# EAGLE design EEG (EAGLE 7.6.0)
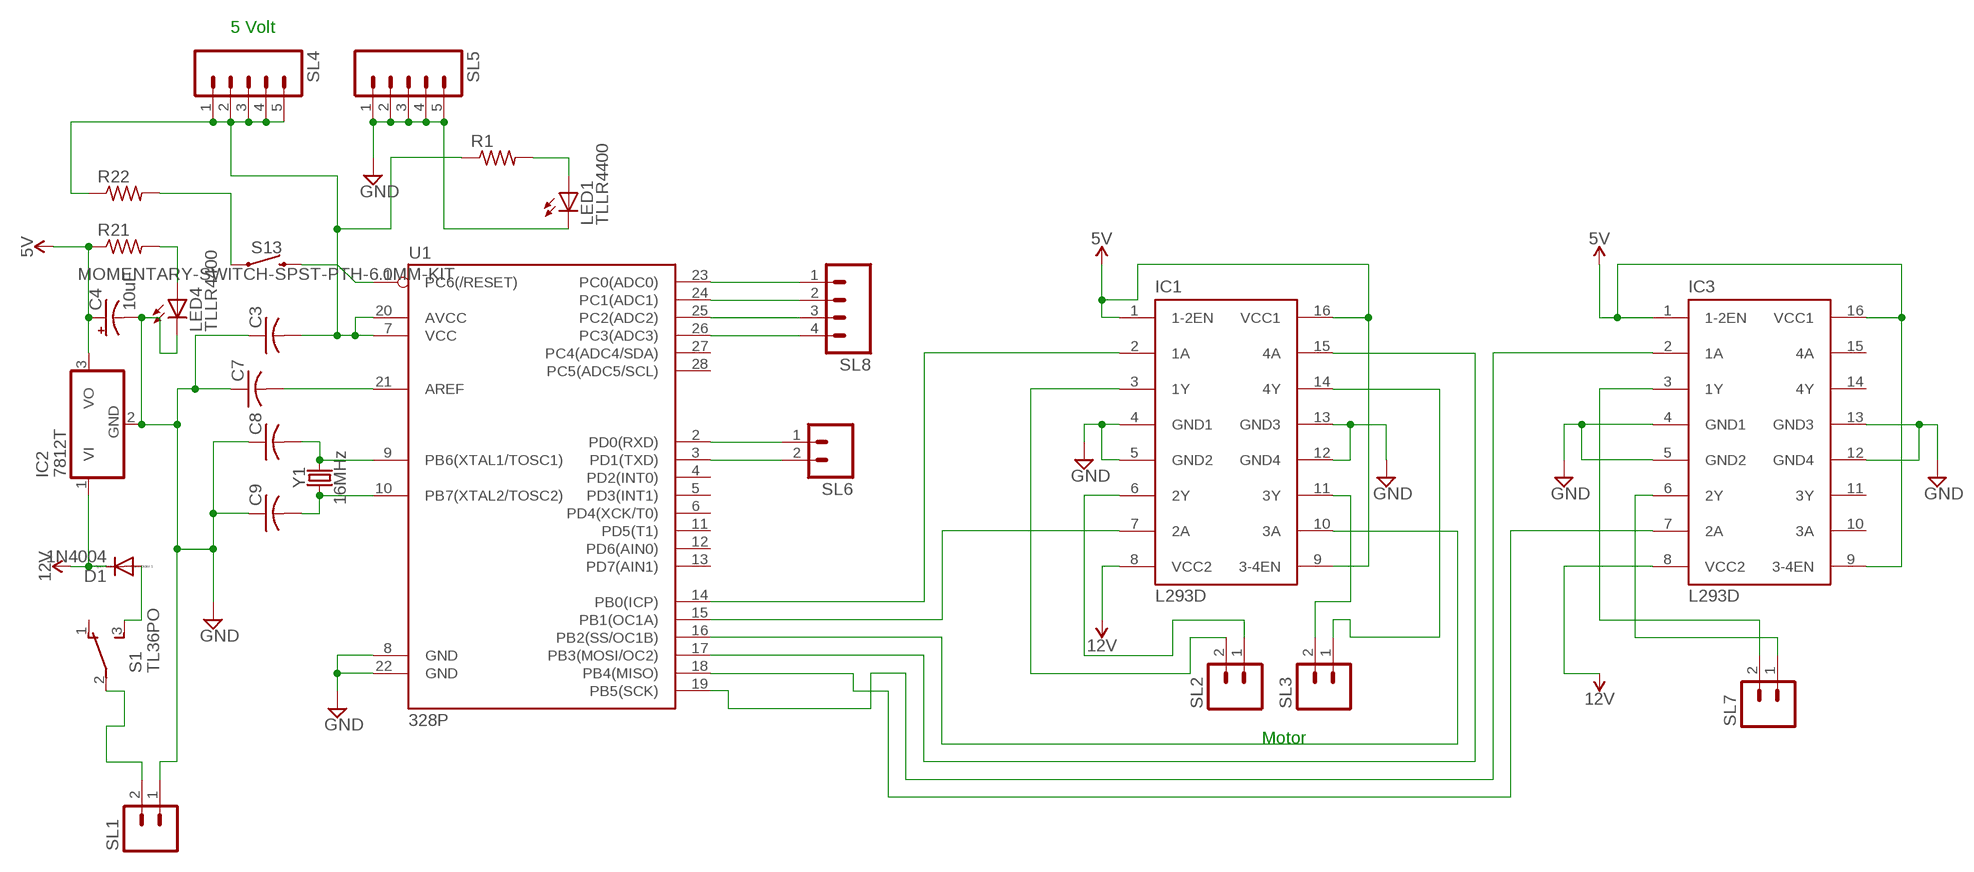
[diagram p0: schematic, sheet 1]

## Parts
C3  C-US025-025X050  [C025-025X050]
C4  10uF  10UF-POLAR-RADIAL-2.5MM-KIT-25V-20%  [CPOL-RADIAL-2.5MM-5MM-KIT]
C7  C-US025-025X050  [C025-025X050]
C8  C-US025-025X050  [C025-025X050]
C9  C-US025-025X050  [C025-025X050]
D1  1N4004  [DO41-10]
IC1  L293D  [DIL16]
IC2  7812T  [TO220H]
IC3  L293D  [DIL16]
LED1  TLLR4400  [LED3MM]
LED4  TLLR4400  [LED3MM]
R1  R-US_0207/12  [0207/12]
R21  R-US_0207/12  [0207/12]
R22  R-US_0207/12  [0207/12]
S1  TL36PO  [TL3XPO]
S13  MOMENTARY-SWITCH-SPST-PTH-6.0MM-KIT  [TACTILE_SWITCH_PTH_6.0MM_KIT]
SL1  MA02  [02PA]
SL2  MA02  [02PA]
SL3  MA02  [02PA]
SL4  MA05  [05PA]
SL5  MA05  [05PA]
SL6  MA02  [02PA]
SL7  MA02  [02PA]
SL8  MA04  [04PA]
U1  328P  ATMEGA328P_PDIP  [DIP28]
Y1  16MHz  CRYSTAL-16MHZPTH-HC49US  [HC49US]

## Nets
5V: C4.1(+) IC1.1(1-2EN) IC1.9(3-4EN) IC1.16(VCC1) IC2.3(VO) IC3.1(1-2EN) IC3.9(3-4EN) IC3.16(VCC1) R21.1
12V: D1.C IC1.8(VCC2) IC2.1(VI) IC3.8(VCC2)
GND: C3.1 C4.2(-) C7.1 C8.1 C9.1 IC1.4(GND1) IC1.5(GND2) IC1.12(GND4) IC1.13(GND3) IC2.2(GND) IC3.4(GND1) IC3.5(GND2) IC3.12(GND4) IC3.13(GND3) LED1.K(C) LED4.K(C) SL1.1 SL5.1 SL5.2 SL5.3 SL5.4 SL5.5 U1.8(GND) U1.22(GND)
N$1: C7.2 U1.21(AREF)
N$2: S1.2(P) SL1.2
N$3: C8.2 U1.9(PB6(XTAL1/TOSC1)) Y1.2
N$4: C9.2 U1.10(PB7(XTAL2/TOSC2)) Y1.1
N$5: LED4.A R21.2
N$6: D1.A S1.3(S)
N$7: IC1.3(1Y) SL2.2
N$8: R22.2 S13.1
N$9: S13.3 U1.1(PC6(/RESET))
N$10: IC3.2(1A) U1.19(PB5(SCK))
N$11: IC3.7(2A) U1.18(PB4(MISO))
N$12: IC3.3(1Y) SL7.2
N$13: IC1.2(1A) U1.14(PB0(ICP))
N$14: IC1.7(2A) U1.15(PB1(OC1A))
N$15: IC1.10(3A) U1.16(PB2(SS/OC1B))
N$16: IC1.15(4A) U1.17(PB3(MOSI/OC2))
N$17: C3.2 R1.1 R22.1 SL4.1 SL4.2 SL4.3 SL4.4 SL4.5 U1.7(VCC) U1.20(AVCC)
N$18: IC3.6(2Y) SL7.1
N$20: LED1.A R1.2
N$21: SL6.1 U1.2(PD0(RXD))
N$22: SL6.2 U1.3(PD1(TXD))
N$24: SL8.1 U1.23(PC0(ADC0))
N$25: SL8.2 U1.24(PC1(ADC1))
N$26: SL8.3 U1.25(PC2(ADC2))
N$27: SL8.4 U1.26(PC3(ADC3))
N$31: IC1.14(4Y) SL3.1
N$33: IC1.6(2Y) SL2.1
N$34: IC1.11(3Y) SL3.2
Unconnected: IC3.10(3A) IC3.11(3Y) IC3.14(4Y) IC3.15(4A) S1.1(O) U1.4(PD2(INT0)) U1.5(PD3(INT1)) U1.6(PD4(XCK/T0)) U1.11(PD5(T1)) U1.12(PD6(AIN0)) U1.13(PD7(AIN1)) U1.27(PC4(ADC4/SDA)) U1.28(PC5(ADC5/SCL))

## Notes on the sheet
- 5 Volt
- Motor

## Library data of the parts
C3 C7-C9 = adafruit:C-US: CAPACITOR, American symbol
C4 = SparkFun-Capacitors:10UF-POLAR: 10.0µF polarized capacitors A capacitor is a passive two-terminal electrical component used to store electrical energy temporarily in an electric field.; PROD_ID: CAP-08440
D1 = diode:1N4004: DIODE general purpose rectifier, 1 A
IC1 IC3 = st-microelectronics:L293D: PUSH-PULL 4 CHANNEL DRIVER; MPN: L293D; OC_FARNELL: 9589619; OC_NEWARK: 56P8249
IC2 = linear:78*: Positive VOLTAGE REGULATOR Source: http://cache.national.com/ds/LM/LM78L05.pdf http://www.fairchildsemi.com/ds/LM/LM7805.pdf
LED1 LED4 = led:TLLR4400: Low Current (2mA) LED 3 mm Tinted Diffused Package color RED Source: Data sheet <http://www.farnell.com/datasheets/391100.pdf>; MF: VISHAY SEMICONDUCTOR; OC_FARNELL: 1612437
R1 R21 R22 = rcl:R-US_: RESISTOR, American symbol
S1 = switch:TL36PO: TINY SWITCH ON - ON Source: http://www2.produktinfo.conrad.com/datenblaetter/700000-724999/705152-da-01-de-Subminiaturschalter_TL_36YO.pdf
S13 = SparkFun-Switches:MOMENTARY-SWITCH-SPST: Momentary Switch (Pushbutton) - SPST Normally-open (NO) SPST momentary switches (buttons, pushbuttons). Variants PTH-12MM - 12mm square, through-hole Momentary Pushbutton Switch - 12mm Square <https://www.sparkfun.com/products/9190> (COM-09190) PTH-6.0MM, PTH-6.0MM-KIT - 6.0mm square, through-hole Mini Pushbutton Switch <https://www.sparkfun.com/products/97> (COM-00097) KIT package intended for soldering kit's - only one side of pads' copper is exposed. PTH-RIGHT-ANGLE-KIT - Right-angle, through-hole Right Angle Tactile Button <https://www.sparkfun.com/products/10791> - Used on SparkFun BigTime Watch Kit <https://www.sparkfun.com/products/11734> SMD-12MM - 12mm square, surface-mount Tactile Button - SMD (12mm) <https://www.sparkfun.com/products/12993> (COM-12993) Used on SparkFun PicoBoard <https://www.sparkfun.com/products/11888> SMD-4.5MM - 4.5mm Square Trackball Switch Used on SparkFun Blackberry Trackballer Breakout <https://www.sparkfun.com/products/13169> SMD-4.6MMX2.8MM - 4.60mm x 2.80mm, surface mount Used on SparkFun SAMD21 Mini Breakout <https://www.sparkfun.com/products/13664> SMD-5.2MM, SMD-5.2-REDUNDANT - 5.2mm square, surface-mount Mini Pushbutton Switch - SMD <https://www.sparkfun.com/products/8720> (COM-08720) Used on Arduino Pro Mini <https://www.sparkfun.com/products/11114> REDUNDANT package connects both switch circuits together SMD-6.0X3.5MM - 6.0 x 3.5mm, surface mount Momentary Reset Switch SMD <https://www.sparkfun.com/products/8229> (COM-08229) SMD-6.2MM-TALL - 6.2mm square, surface mount Tactile Button - SMD (6mm) <https://www.sparkfun.com/products/12992> Used on SparkFun Digital Sandbox <https://www.sparkfun.com/products/12651> SMD-RIGHT-ANGLE - Right-angle, surface mount Used on SparkFun Block for Intel® Edison - Arduino <https://www.sparkfun.com/products/13036>; PROD_ID: SWCH-08441; SF_SKU: COM-00097
SL1-SL3 SL6 SL7 = con-amp-quick:MA02: AMP QUICK CONNECTOR; OC_FARNELL: unknown; OC_NEWARK: unknown
SL4 SL5 = con-amp-quick:MA05: AMP QUICK CONNECTOR; OC_FARNELL: unknown; OC_NEWARK: unknown
SL8 = con-amp-quick:MA04: AMP QUICK CONNECTOR; OC_FARNELL: unknown; OC_NEWARK: unknown
U1 = SparkFun-IC-Microcontroller:ATMEGA328P_PDIP: Atmel 328P Through hole ATMEGA328P uC used in the Arduino 32kb flash, 1k EEPROM, 2k SRAM Datasheet <http://www.sparkfun.com/datasheets/Components/SMD/ATMega328.pdf> SparkFun Products Storefront component: AVR 28 Pin 20MHz 32K 6A/D - ATMega328P <https://www.sparkfun.com/products/9061> (COM-09061) SparkFun Simon Says - Through-Hole Soldering Kit <https://www.sparkfun.com/products/10547> (KIT-10547) SparkFun Learn to Solder - Simon Says <https://www.sparkfun.com/products/13708> (KIT-13708) SparkFun BigTime Watch Kit <https://www.sparkfun.com/products/11734> (KIT-11734) SparkFun ClockIt <https://www.sparkfun.com/products/10930> (KIT-10930) SparkFun Serial Enabled LCD Kit <https://www.sparkfun.com/products/10097> (LCD-10097) SparkFun Simon Tilts - Through Hole Soldering Kit <https://www.sparkfun.com/products/12634> (KIT-12634) SparkFun Frequency Counter Kit <https://www.sparkfun.com/products/10140> (KIT-10140) FabFM Radio Kit <https://www.sparkfun.com/products/11043> (KIT-11043) SparkFun Binary Blaster Kit <https://www.sparkfun.com/products/12037> (KIT-12037) SparkFun Metro-Gnome <https://www.sparkfun.com/products/9236> (KIT-09236) ATmega328 with Arduino Optiboot (Uno) <https://www.sparkfun.com/products/10524> (DEV-10524); PROD_ID: IC-09136
Y1 = SparkFun-Clocks:CRYSTAL-16MHZ: 16MHz Crystal Digikey Example <http://www.digikey.com/product-search/en?keywords=535-9122-1-ND> Frequency: 16MHz Frequency Stability: ±50ppm Frequency Tolerance: ±20ppm Load Capacitance: 18pF SparkFun Products: Pro Micro -5V/16MHz <https://www.sparkfun.com/products/12640> SparkFun Serial Enabled LCD Kit <https://www.sparkfun.com/products/10097>; PROD_ID: XTAL-08181; SF_ID: COM-00536

## Board
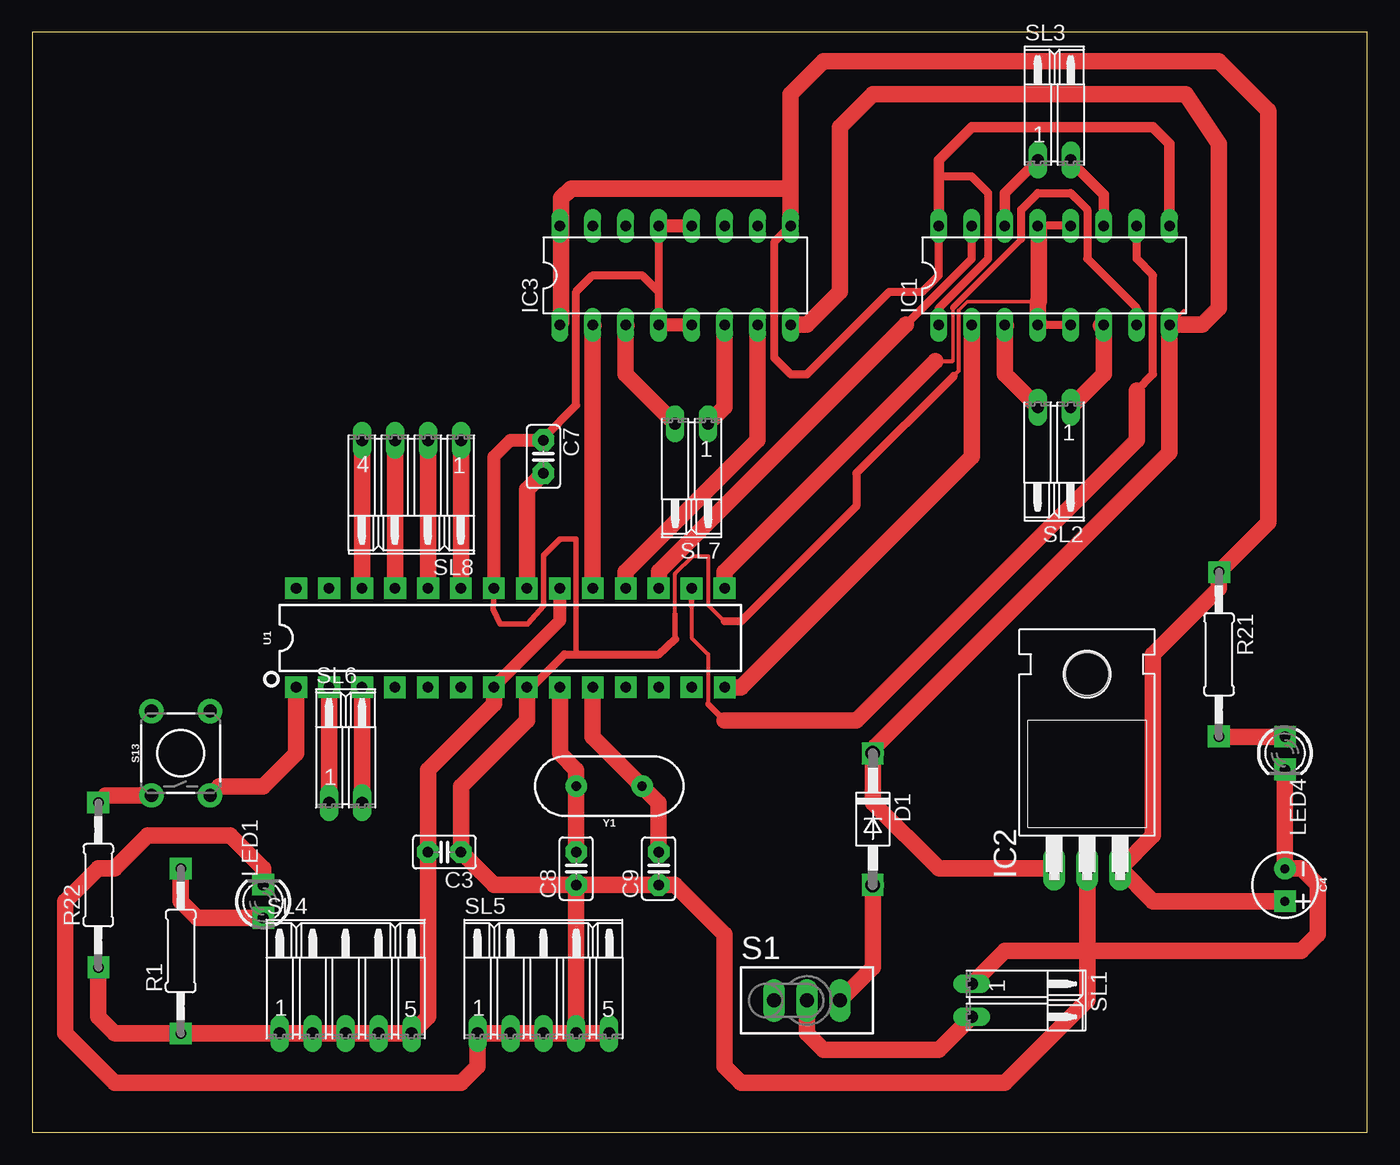
[diagram p1: board, top side]

Size 102.85 x 84.76 mm. Coordinates in mm from the lower left corner, seen from the top.
Outline: 0,0 102.85,0 102.85,84.76 0,84.76 0,0
Copper layers (1*16): Top 0.035mm / dielectric 1.5mm / Bottom 0.035mm
Design rules "default": minimum track width 10mil, minimum drill 24mil, track to track 8mil, track to pad 8mil, pad to pad 8mil, via to via 8mil, smd to smd 8mil, copper to edge 40mil, drill to drill 8mil, minimum pad ring 10mil, minimum via ring 8mil, stop-mask expansion 4mil, vias tented up to drill 0mil, thermal gap 10mil

### Footprints (pad centres in the part's own frame; a part is rotated, then mirrored left to right if it is on the bottom)
C025-025X050 = drill 0.813 pad 1.676 octagon: 1 -1.27,0; 2 1.27,0
CPOL-RADIAL-2.5MM-5MM-KIT = drill 0.7 pad 1.651 square: 1 1.25,0 | drill 0.7 pad 1.651: 2 -1.25,0
DO41-10 = drill 1.118: A 5.08,0; C -5.08,0
DIL16 = drill 0.813 long: 1 -8.89,-3.81; 2 -6.35,-3.81; 3 -3.81,-3.81; 4 -1.27,-3.81; 5 1.27,-3.81; 6 3.81,-3.81; 7 6.35,-3.81; 8 8.89,-3.81; 9 8.89,3.81; 10 6.35,3.81; 11 3.81,3.81; 12 1.27,3.81; 13 -1.27,3.81; 14 -3.81,3.81; 15 -6.35,3.81; 16 -8.89,3.81
TO220H = drill 1.118 long: 1 -2.54,-10.16; 2 0,-10.16; 3 2.54,-10.16 | hole 3.302: 0,4.826
LED3MM = drill 0.813 octagon: A -1.27,0; K 1.27,0
0207/12 = drill 0.813 octagon: 1 -6.35,0; 2 6.35,0
TL3XPO = drill 1.1 pad 1.422 long: 1 -2.54,0; 2 0,0; 3 2.54,0
TACTILE_SWITCH_PTH_6.0MM_KIT = drill 1.016 pad 1.88: 1 -3.251,2.261; 2 3.251,2.261; 3 -3.251,-2.261; 4 3.251,-2.261
02PA = drill 0.914 long: 1 -1.27,0; 2 1.27,0
05PA = drill 0.914 long: 1 -5.08,0; 2 -2.54,0; 3 0,0; 4 2.54,0; 5 5.08,0
04PA = drill 0.914 long: 1 -3.81,0; 2 -1.27,0; 3 1.27,0; 4 3.81,0
DIP28 = drill 0.813 pad 1.626: 1 -16.51,-3.81; 2 -13.97,-3.81; 3 -11.43,-3.81; 4 -8.89,-3.81; 5 -6.35,-3.81; 6 -3.81,-3.81; 7 -1.27,-3.81; 8 1.27,-3.81; 9 3.81,-3.81; 10 6.35,-3.81; 11 8.89,-3.81; 12 11.43,-3.81; 13 13.97,-3.81; 14 16.51,-3.81; 15 16.51,3.81; 16 13.97,3.81; 17 11.43,3.81; 18 8.89,3.81; 19 6.35,3.81; 20 3.81,3.81; 21 1.27,3.81; 22 -1.27,3.81; 23 -3.81,3.81; 24 -6.35,3.81; 25 -8.89,3.81; 26 -11.43,3.81; 27 -13.97,3.81; 28 -16.51,3.81
HC49US = drill 0.7 pad 1.651: 1 -2.54,0; 2 2.54,0

### Placement (x,y rotation side)
C3  31.75,21.59 180 top
C4  96.52,19.05 270 top
C7  39.37,52.07 270 top
C8  41.91,20.32 90 top
C9  48.26,20.32 90 top
D1  64.77,24.13 270 top
IC1  78.74,66.04 0 top
IC2  81.28,30.48 0 top
IC3  49.53,66.04 0 top
LED1  17.78,17.78 90 top
LED4  96.52,29.21 270 top
R1  11.43,13.97 90 top
R21  91.44,36.83 270 top
R22  5.08,19.05 90 top
S1  59.69,10.16 0 top
S13  11.43,29.21 90 top
SL1  72.39,10.16 270 top
SL2  78.74,55.88 180 top
SL3  78.74,74.93 0 top
SL4  24.13,7.62 0 top
SL5  39.37,7.62 0 top
SL6  24.13,25.4 0 top
SL7  50.8,54.61 180 top
SL8  29.21,53.34 180 top
U1  36.83,38.1 0 top
Y1  44.45,26.67 180 top

### Tracks (layer width: path | path; a pad name or v marks a point on that pad's centre or on a via)
5V
  Top 0.254: 40.74,62.41 IC3.1 | 40.74,69.72 IC3.16 | 57.89,69.95 58.34,69.95 IC3.9 | 69.77,69.72 IC1.16
  Top 0.61: IC1.1 69.85,63.5 73.66,67.31 73.66,72.39 72.39,73.66 69.85,73.66 | IC3.9 57.15,68.58 57.15,59.69 58.42,58.42 59.69,58.42 66.04,64.77 68.58,64.77 69.85,66.04 IC1.16
  Top 0.813: 69.77,69.72 69.85,69.8 IC1.16 69.85,73.66 69.85,74.93 72.39,77.47 86.36,77.47 87.63,76.2 IC1.9
  Top 1.27: C4.1 96.5,17.78 86.36,17.78 IC2.3 86.36,22.86 86.36,36.83 91.44,41.91 R21.1 95.25,46.99 95.25,78.74 91.44,82.55 60.96,82.55 58.42,80.01 58.42,72.63 | 58.42,72.63 IC3.9 | 40.74,62.41 40.74,69.72 40.74,69.75 | 40.74,69.75 IC3.16 | 40.74,69.75 40.74,71.98 41.49,72.72 58.32,72.72 58.42,72.63
12V
  Top 0.254: 88.75,63.32 87.83,62.41 IC1.8 87.61,62.18 87.61,60.58 | 58.57,62.41 IC3.8 | 64.97,29.72 D1.C
  Top 1.27: D1.C 64.77,25.4 69.85,20.32 IC2.1 | 64.97,29.72 87.63,52.38 IC1.8 90.17,62.23 91.44,63.5 91.44,76.2 88.9,80.01 64.77,80.01 62.23,77.47 62.23,64.77 59.69,62.23 58.75,62.23 58.57,62.41
GND
  Top 0.254: 50.8,62.41 IC3.5 | 48.28,69.95 IC3.13 48.28,69.72 | 50.8,69.95 IC3.12 | 48.28,62.41 IC3.4 | 35.71,42.06 U1.22 | 39.37,53.26 C7.1 39.37,53.49 | 77.55,62.41 IC1.4 | 77.55,69.72 IC1.13 | 77.55,64.01 77.47,64.01 72.06,64.01 71.37,63.32 | 38.68,34.52 U1.8
  Top 0.305: 49.53,39.9 49.53,43.05 50.9,44.4 52.07,44.4 52.07,40.64 53.34,39.37 | 71.37,63.32 71.37,58.67 70.99,58.29
  Top 0.406: U1.22 35.52,40.34 36.03,39.19 38.15,39.19 39.37,40.56 39.37,44.45 40.64,45.72 41.91,45.72 41.91,36.83 | 49.53,38 49.53,39.9
  Top 0.61: IC1.4 IC1.5 | IC1.12 IC1.13 | 38.68,34.52 41,36.83 41.91,36.83 48.26,36.83 49.53,38 | 39.37,53.49 41.91,56.03 41.91,64.77 43.18,66.04 46.99,66.04 48.26,64.77 | 48.26,64.77 IC3.4 | 48.28,69.72 48.26,69.7 48.26,64.77 | 70.99,58.29 63.5,50.8 63.5,48.26 54.61,39.37 53.34,39.37
  Top 1.016: 35.71,42.06 35.56,42.22 35.56,52.07 36.83,53.34 C7.1 | 48.28,69.95 48.39,69.85 IC3.12 | 48.28,62.41 48.46,62.23 IC3.5
  Top 1.27: SL5.4 SL5.3 SL5.2 SL5.1 34.29,5.08 33.02,3.81 6.35,3.81 2.54,7.62 2.54,17.78 5.08,20.32 6.35,20.32 8.89,22.86 15.24,22.86 17.78,20.32 LED1.K | SL5.4 SL5.5 | SL5.4 C8.1 | C8.1 C9.1 49.53,19.05 53.34,15.24 53.34,5.08 54.61,3.81 74.93,3.81 81.28,10.16 81.28,13.97 | C8.1 35.56,19.05 C3.1 33.02,26.67 38.1,31.75 U1.8 | 81.28,13.97 IC2.2 | SL1.1 74.93,13.97 81.28,13.97 | LED4.K C4.2 96.54,20.32 97.79,20.32 99.06,19.05 99.06,15.24 97.79,13.97 81.28,13.97 | 77.55,69.72 77.55,64.01 | 77.55,62.41 77.47,62.48 77.47,64.01
N$1
  Top 1.27: C7.2 38.1,49.53 U1.21
N$2
  Top 1.27: S1.2 59.69,7.62 60.96,6.35 69.85,6.35 SL1.2
N$3
  Top 1.27: U1.9 40.64,29.21 41.91,27.94 Y1.2 C8.2
N$4
  Top 1.27: U1.10 43.18,30.48 Y1.1 48.26,25.4 C9.2
N$5
  Top 1.27: R21.2 LED4.A
N$6
  Top 1.27: S1.3 64.77,12.7 D1.A
N$7
  Top 0.254: 75.03,62.18 IC1.3 | 77.32,56.01 SL2.2
  Top 1.27: 75.03,62.18 74.93,62.08 74.93,58.42 SL2.2
N$8
  Top 1.27: R22.2 5.64,25.96 S13.1
N$9
  Top 1.27: S13.3 14.4,26.67 17.78,26.67 20.32,29.21 U1.1
N$10
  Top 0.254: 43.26,62.18 IC3.2 | 43.26,42.06 U1.19
  Top 1.27: 43.26,62.18 43.18,62.1 U1.19
N$11
  Top 0.254: 55.83,62.18 IC3.7 | 45.77,42.06 U1.18
  Top 1.27: 55.83,62.18 55.88,62.13 55.88,53.34 45.72,43.18 U1.18
N$12
  Top 0.254: 45.77,62.18 IC3.3 | 49.43,54.63 SL7.2
  Top 1.27: 45.77,62.18 45.72,62.13 45.72,58.42 SL7.2
N$13
  Top 0.254: 72.29,62.18 IC1.2 | 53.54,34.29 U1.14
  Top 1.27: 53.54,34.29 54.61,34.29 72.39,52.07 IC1.2
N$14
  Top 0.254: 70.92,59.44 70.92,63.5 | 53.54,42.06 U1.15
  Top 0.305: 69.6,59.44 70.92,59.44
  Top 0.406: 76.2,68.83 70.92,63.55 70.92,63.5
  Top 0.61: 76.2,68.83 76.2,71.12 77.47,72.39 80.01,72.39 81.28,71.12 81.28,67.31 85.09,63.5 IC1.7
  Top 1.27: 53.54,42.06 53.34,42.27 53.34,43.18 69.6,59.44
N$15
  Top 0.254: 50.8,41.83 U1.16
  Top 0.305: 50.8,40.56 50.8,38.1 52.07,36.83 52.07,33.02
  Top 0.406: 50.8,41.83 50.8,40.56 | 52.07,33.02 53.34,31.75
  Top 0.61: 85.09,57.15 86.36,58.42 86.36,66.04 85.09,67.31 IC1.10
  Top 1.27: 53.34,31.75 63.5,31.75 85.09,53.34 85.09,57.15
N$16
  Top 0.254: 48.28,42.75 48.28,42.06 U1.17 | 72.29,69.72 IC1.15
  Top 0.61: 67.31,62.23 72.39,67.31 IC1.15
  Top 1.27: 48.28,42.75 48.28,43.2 67.31,62.23
N$17
  Top 0.254: 40.51,41.83 U1.20 | 35.94,34.75 U1.7
  Top 1.016: 35.94,34.75 40.64,39.45 U1.20
  Top 1.27: R22.1 5.08,8.89 6.35,7.62 R1.1 SL4.1 SL4.2 SL4.3 SL4.4 SL4.5 30.48,8.89 C3.2 30.48,27.94 35.56,33.02 U1.7
N$18
  Top 0.254: 53.31,62.18 IC3.6 | 52.17,54.63 SL7.1
  Top 1.27: 53.31,62.18 53.34,62.15 53.34,55.88 SL7.1
N$19  (via drill 0.5 pad 1.68)
  other vias: 20.32,41.92
N$20
  Top 1.27: R1.2 11.43,17.78 12.7,16.51 LED1.A
N$21
  Top 1.27: U1.2 SL6.1
N$22
  Top 1.27: U1.3 SL6.2
N$23  (via drill 0.5 pad 1.68)
  other vias: 22.86,41.92
N$24
  Top 1.27: SL8.1 U1.23
N$25
  Top 1.27: SL8.2 U1.24
N$26
  Top 1.27: SL8.3 U1.25
N$27
  Top 1.27: SL8.4 U1.26
N$28  (via drill 0.5 pad 1.68)
  other vias: 25.4,41.92
N$29  (via drill 0.5 pad 1.68)
  other vias: 27.94,41.92
N$30  (via drill 0.5 pad 1.68)
  other vias: 30.48,41.92
N$31
  Top 0.254: 75.03,69.95 IC1.14 | 77.32,74.75 SL3.1
  Top 0.813: 75.03,69.95 74.93,70.05 74.93,72.39 SL3.1
N$32  (via drill 0.5 pad 1.68)
  other vias: 33.02,41.92
N$33
  Top 0.254: 82.35,62.18 IC1.6 | 80.06,56.01 SL2.1
  Top 1.27: 82.35,62.18 82.55,61.98 82.55,58.42 SL2.1
N$34
  Top 0.254: 82.35,69.95 IC1.11 | 80.06,74.75 SL3.2
  Top 0.813: 80.06,74.75 82.55,72.26 IC1.11
N$35  (via drill 0.5 pad 1.68)
  other vias: 35.56,41.92
N$36  (via drill 0.5 pad 1.68)
  other vias: 38.1,41.91
N$37  (via drill 0.5 pad 1.68)
  other vias: 40.65,41.91
N$38  (via drill 0.5 pad 1.68)
  other vias: 43.19,41.92
N$39  (via drill 0.5 pad 1.68)
  other vias: 45.72,41.91
N$40  (via drill 0.5 pad 1.68)
  other vias: 48.25,41.92
N$41  (via drill 0.5 pad 1.68)
  other vias: 50.8,41.91
N$42  (via drill 0.5 pad 1.68)
  other vias: 53.34,41.93
N$43  (via drill 0.5 pad 1.68)
  other vias: 20.32,34.3
N$44  (via drill 0.5 pad 1.68)
  other vias: 22.86,34.29
N$45  (via drill 0.5 pad 1.68)
  other vias: 25.4,34.29
N$46  (via drill 0.5 pad 1.68)
  other vias: 27.94,34.29
N$47  (via drill 0.5 pad 1.68)
  other vias: 30.48,34.28
N$48  (via drill 0.5 pad 1.68)
  other vias: 33.03,34.29
N$49  (via drill 0.5 pad 1.68)
  other vias: 35.56,34.3
N$50  (via drill 0.5 pad 1.68)
  other vias: 38.11,34.29
N$51  (via drill 0.5 pad 1.68)
  other vias: 40.64,34.29
N$52  (via drill 0.5 pad 1.68)
  other vias: 43.18,34.29
N$53  (via drill 0.5 pad 1.68)
  other vias: 45.72,34.3
N$54  (via drill 0.5 pad 1.68)
  other vias: 48.26,34.28
N$55  (via drill 0.5 pad 1.68)
  other vias: 50.79,34.29
N$56  (via drill 0.5 pad 1.68)
  other vias: 53.34,34.28
N$57  (via drill 0.5 pad 1.68)
  other vias: 11.42,7.61
N$58  (via drill 0.5 pad 1.68)
  other vias: 11.42,20.32
N$59  (via drill 0.5 pad 1.68)
  other vias: 17.78,19.08
N$60  (via drill 0.5 pad 1.68)
  other vias: 17.79,16.52
N$61  (via drill 0.5 pad 1.68)
  other vias: 5.09,12.7
N$62  (via drill 0.5 pad 1.68)
  other vias: 5.08,25.41
N$63  (via drill 0.5 pad 1.68)
  other vias: 64.75,29.2
N$64  (via drill 0.5 pad 1.68)
  other vias: 64.75,19.07
N$65  (via drill 0.5 pad 1.68)
  other vias: 96.54,30.48
N$66  (via drill 0.5 pad 1.68)
  other vias: 96.54,27.97
N$67  (via drill 0.5 pad 1.68)
  other vias: 91.42,30.49
N$68  (via drill 0.5 pad 1.68)
  other vias: 91.46,43.16